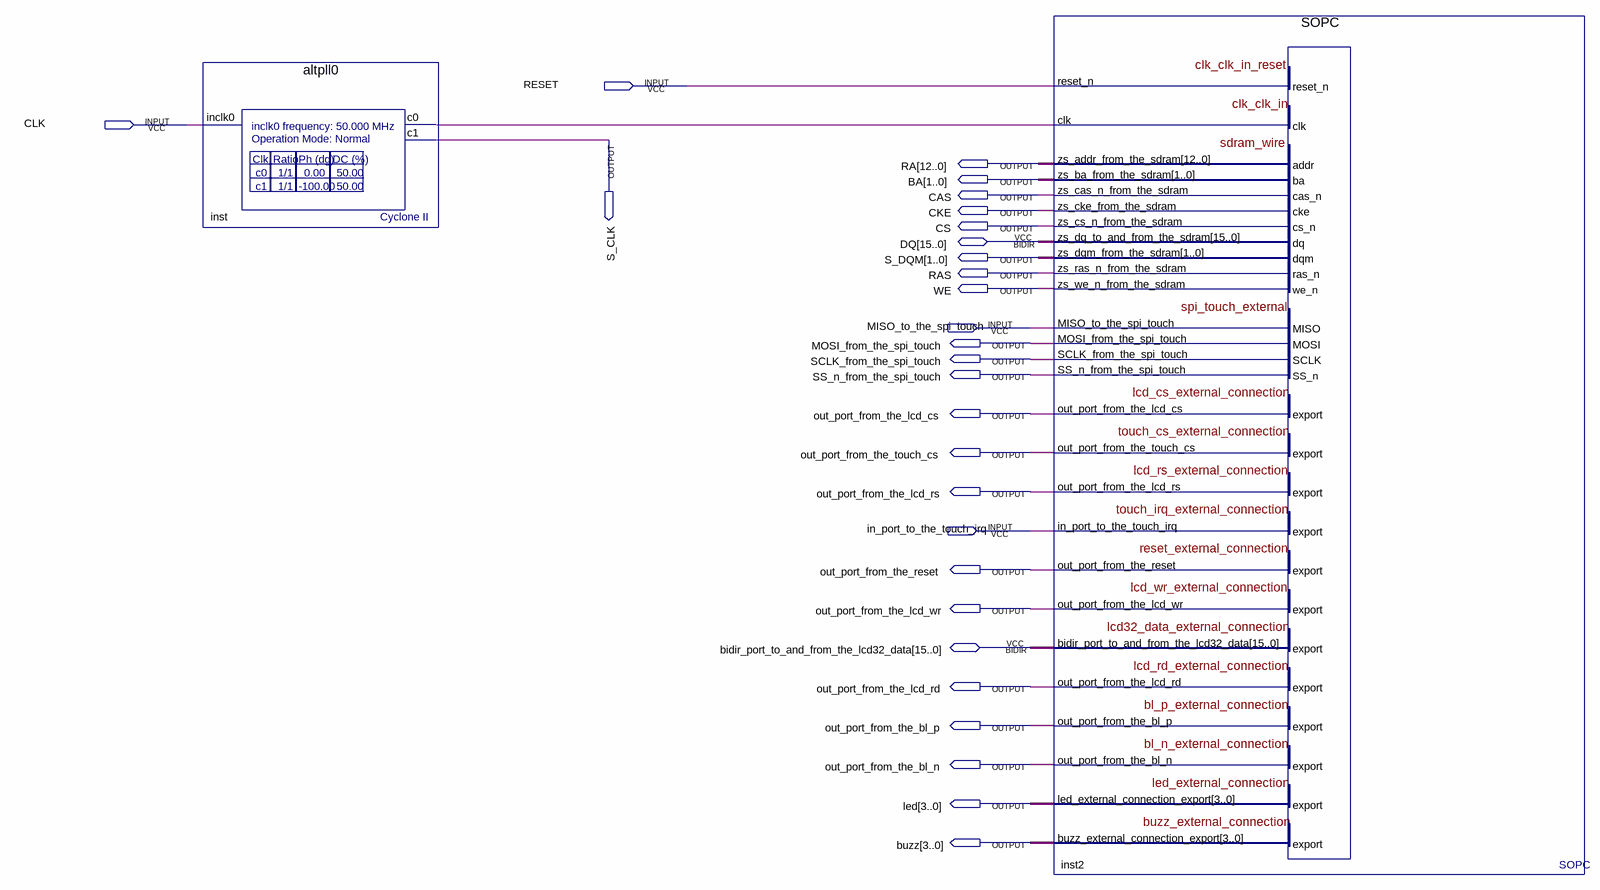
[diagram p0: schematic sheet]
// Quartus schematic lcd_nios.bdf as structural Verilog: 2 symbols, 28 pins
module lcd_nios (
  input  RESET,
  input  CLK,
  input  MISO_to_the_spi_touch,
  input  in_port_to_the_touch_irq,
  inout  [15:0] DQ,
  inout  [15:0] bidir_port_to_and_from_the_lcd32_data,
  output S_CLK,
  output [12:0] RA,
  output [1:0] BA,
  output CAS,
  output CKE,
  output CS,
  output [1:0] S_DQM,
  output RAS,
  output WE,
  output MOSI_from_the_spi_touch,
  output SCLK_from_the_spi_touch,
  output SS_n_from_the_spi_touch,
  output out_port_from_the_lcd_cs,
  output out_port_from_the_touch_cs,
  output out_port_from_the_lcd_rs,
  output out_port_from_the_reset,
  output out_port_from_the_lcd_wr,
  output out_port_from_the_lcd_rd,
  output out_port_from_the_bl_p,
  output out_port_from_the_bl_n,
  output [3:0] led,
  output [3:0] buzz
);

  wire inst_c0;

  altpll0 inst (.inclk0(CLK), .c0(inst_c0), .c1(S_CLK));
  SOPC inst2 (
    .reset_n(RESET), .clk(inst_c0), .MISO_to_the_spi_touch(MISO_to_the_spi_touch),
    .in_port_to_the_touch_irq(in_port_to_the_touch_irq), .zs_addr_from_the_sdram(RA),
    .zs_ba_from_the_sdram(BA), .zs_cas_n_from_the_sdram(CAS), .zs_cke_from_the_sdram(CKE),
    .zs_cs_n_from_the_sdram(CS), .zs_dqm_from_the_sdram(S_DQM), .zs_ras_n_from_the_sdram(RAS),
    .zs_we_n_from_the_sdram(WE), .MOSI_from_the_spi_touch(MOSI_from_the_spi_touch),
    .SCLK_from_the_spi_touch(SCLK_from_the_spi_touch), .SS_n_from_the_spi_touch(SS_n_from_the_spi_touch),
    .out_port_from_the_lcd_cs(out_port_from_the_lcd_cs),
    .out_port_from_the_touch_cs(out_port_from_the_touch_cs),
    .out_port_from_the_lcd_rs(out_port_from_the_lcd_rs), .out_port_from_the_reset(out_port_from_the_reset),
    .out_port_from_the_lcd_wr(out_port_from_the_lcd_wr), .out_port_from_the_lcd_rd(out_port_from_the_lcd_rd),
    .out_port_from_the_bl_p(out_port_from_the_bl_p), .out_port_from_the_bl_n(out_port_from_the_bl_n),
    .led_external_connection_export(led), .buzz_external_connection_export(buzz),
    .zs_dq_to_and_from_the_sdram(DQ),
    .bidir_port_to_and_from_the_lcd32_data(bidir_port_to_and_from_the_lcd32_data));
endmodule
